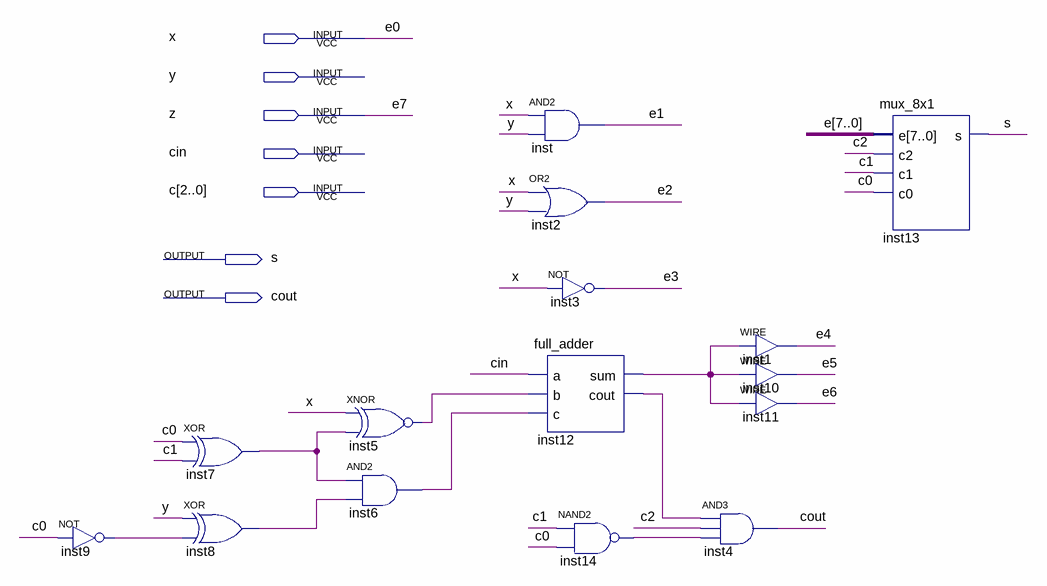
[diagram p0: schematic sheet]
// Quartus schematic bloco_unitario.bdf as structural Verilog: 15 symbols, 7 pins
module bloco_unitario (
  input  x,
  input  y,
  input  z,
  input  cin,
  input  [2:0] c,
  output s,
  output cout
);

  wire inst5_out, inst6_out, inst7_out, inst8_out, inst9_out, inst12_cout, inst12_sum, inst14_out;
  wire [6:1] e;

  not inst9 (inst9_out, c[0]);
  xor inst7 (inst7_out, c[0], c[1]);
  xor inst8 (inst8_out, y, inst9_out);
  xnor inst5 (inst5_out, x, inst7_out);
  and inst6 (inst6_out, inst7_out, inst8_out);
  and inst (e[1], x, y);
  or inst2 (e[2], x, y);
  not inst3 (e[3], x);
  full_adder inst12 (.a(cin), .b(inst5_out), .c(inst6_out), .sum(inst12_sum), .cout(inst12_cout));
  nand inst14 (inst14_out, c[1], c[0]);
  and inst4 (cout, inst12_cout, c[2], inst14_out);
  assign e[4] = inst12_sum;  // WIRE inst1
  assign e[5] = inst12_sum;  // WIRE inst10
  assign e[6] = inst12_sum;  // WIRE inst11
  mux_8x1 inst13 (.e({z, e, x}), .c2(c[2]), .c1(c[1]), .c0(c[0]), .s(s));

  // Other names for the same wires on the sheet: e (some bits) = {z, x}; e0 = x; e7 = z
endmodule
